# EAGLE board NIPCB (EAGLE 9.7.0)
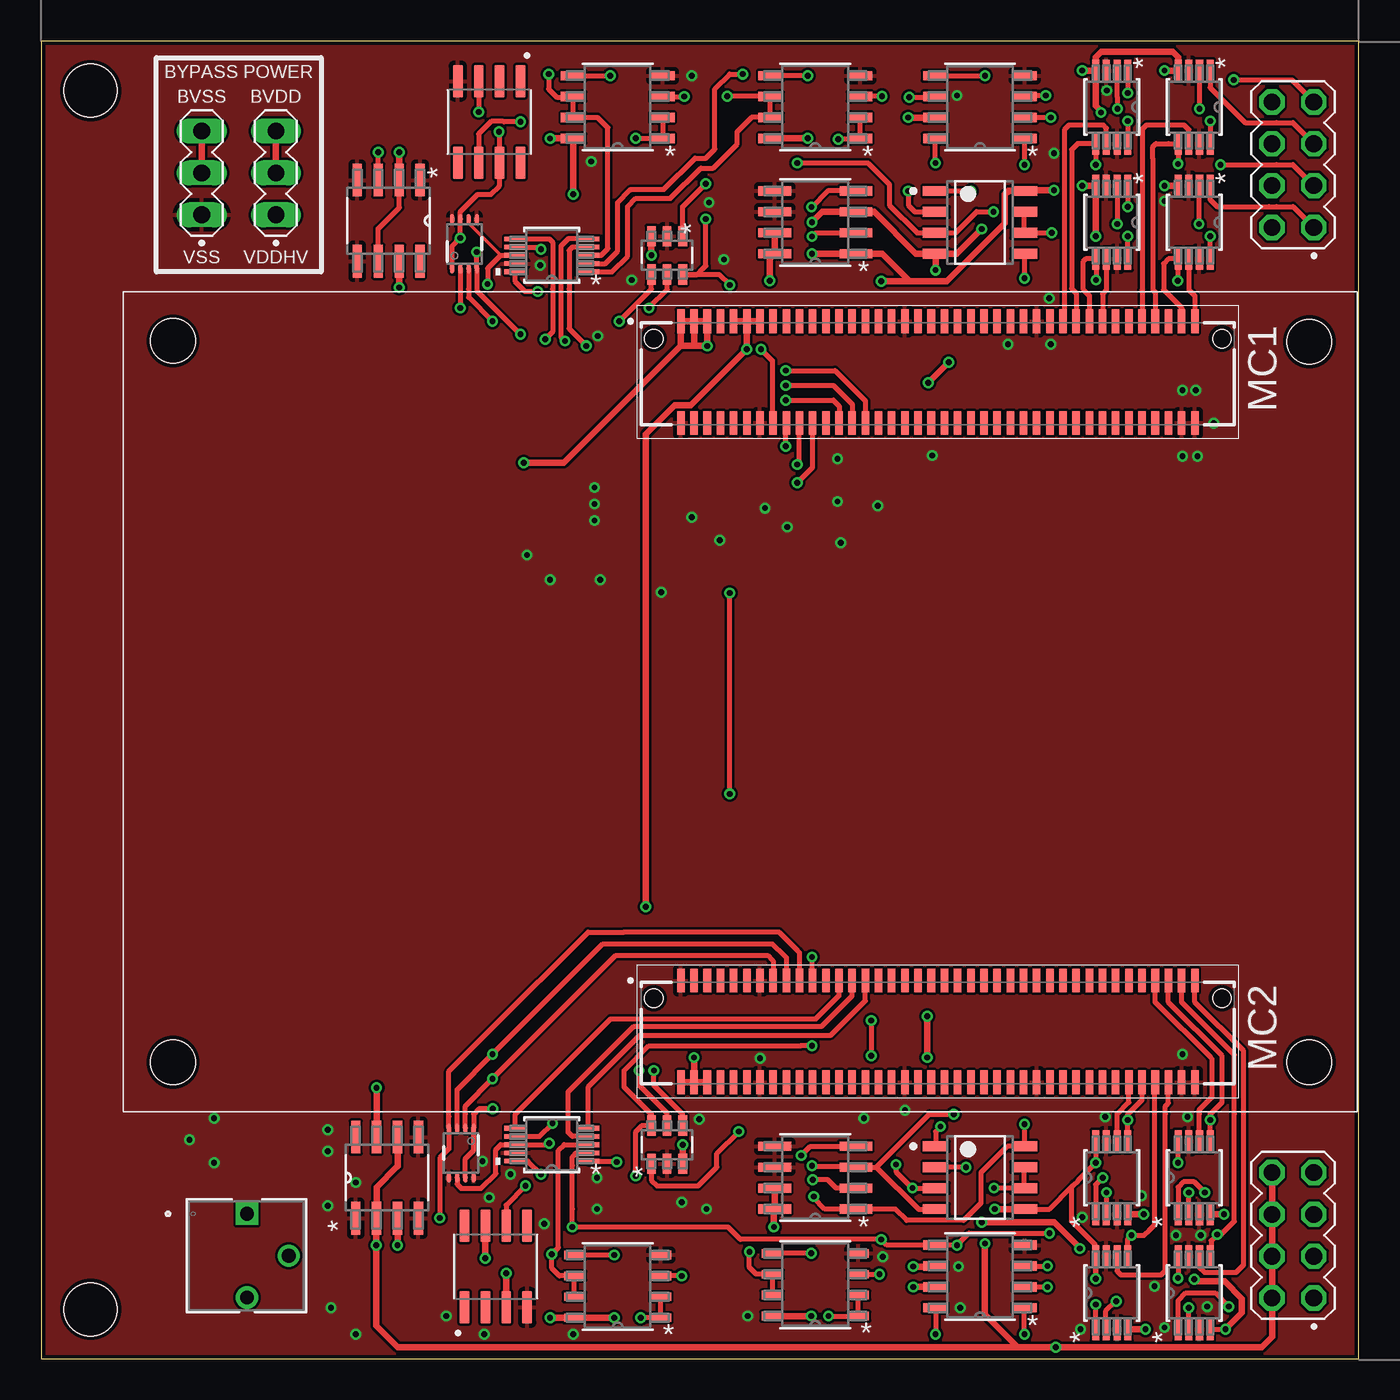
[diagram p6: board, top side]
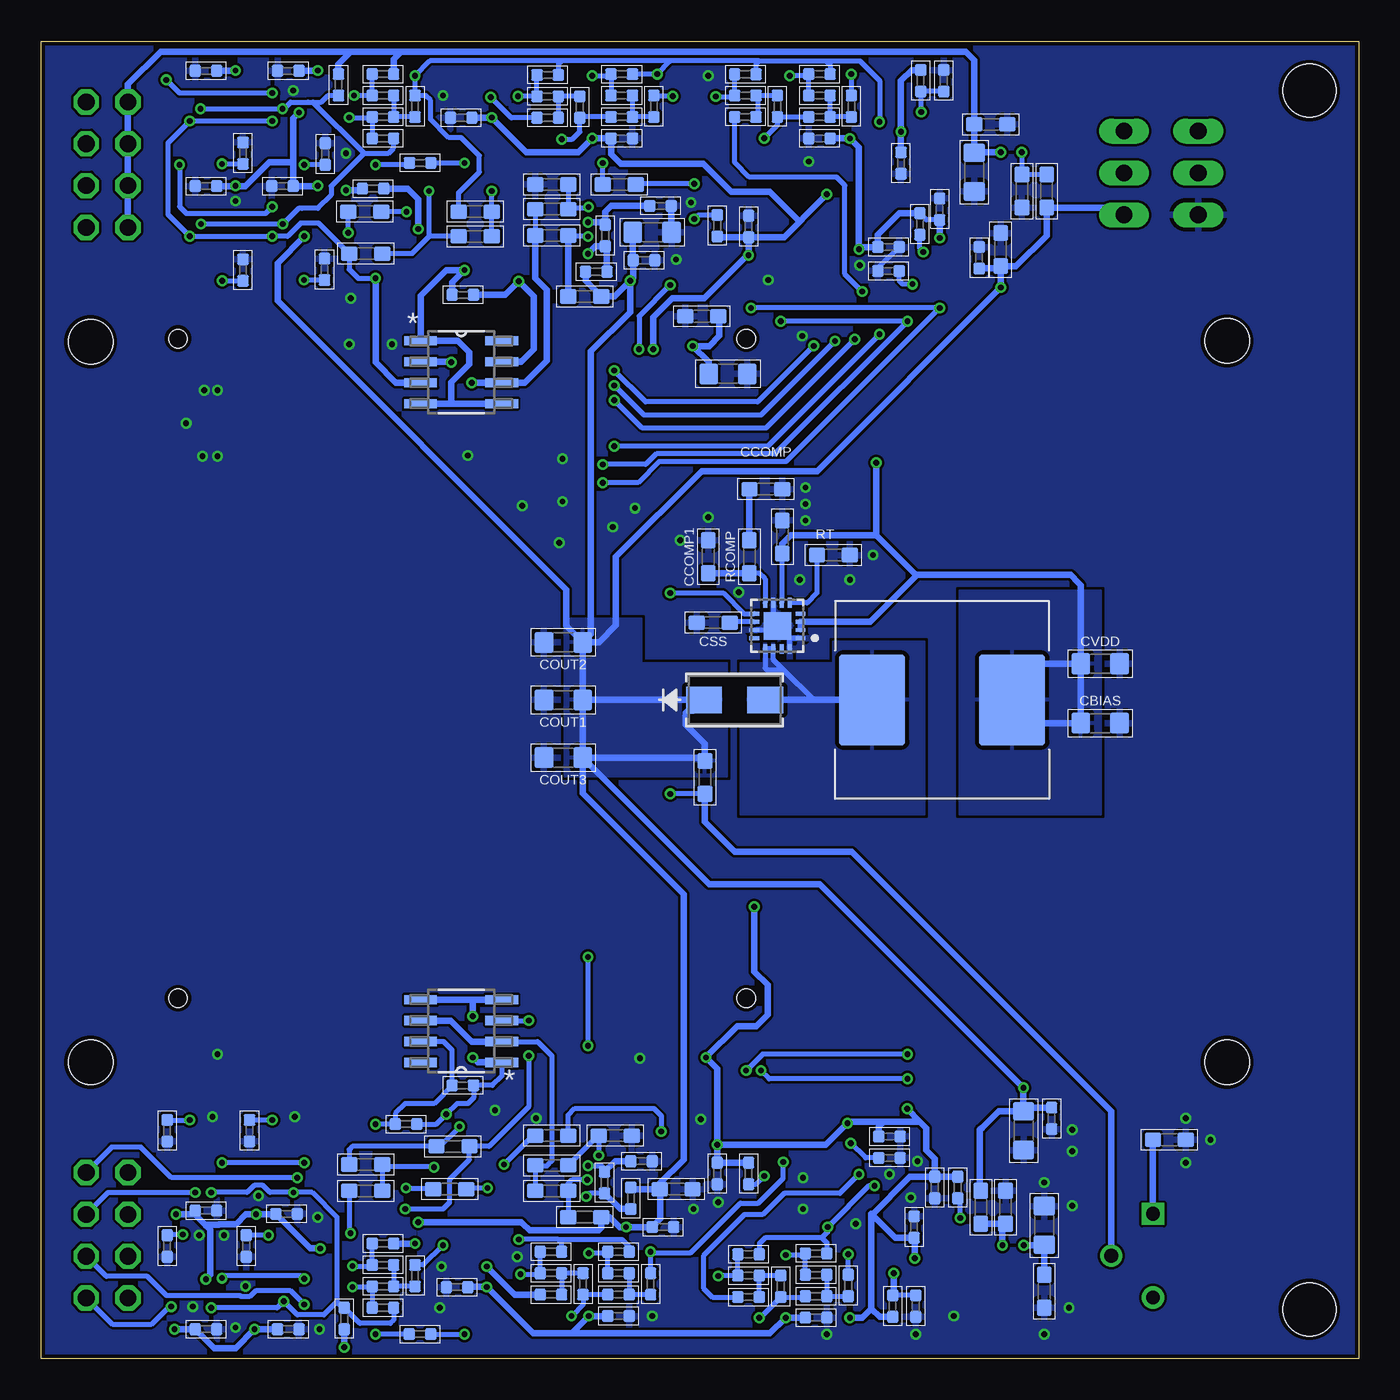
[diagram p7: board, bottom side, seen from below]

Size 80 x 80 mm. Coordinates in mm from the lower left corner, seen from the top.
Outline: 80,80 0,80 0,0 80,0 80,80
Copper layers (1*16): Top 0.035mm / dielectric 1.5mm / Bottom 0.035mm
Design rules "PCBWay-Default": minimum track width 6mil, minimum drill 0.3mm, track to track 6mil, track to pad 6mil, pad to pad 0.2mm, via to via 0.2mm, smd to smd 6mil, copper to edge 0.25mm, drill to drill 8mil, minimum pad ring 6mil, minimum via ring 6mil, stop-mask expansion 4mil, vias tented up to drill 25mil, thermal gap 10mil
Net classes: 1 power: width 0.2 mm
Holes 2.7 mm at 8,18 8,61.8 77,61.75 77,18
Holes 3.2 mm at 3,77 3,3

## Footprints (pad centres in the part's own frame; a part is rotated, then mirrored left to right if it is on the bottom)
DCU0008A_L = smd 0.6 x 0.25: 1 -1.5,0.75; 2 -1.5,0.25; 3 -1.5,-0.25; 4 -1.5,-0.75; 5 1.5,-0.75; 6 1.5,-0.25; 7 1.5,0.25; 8 1.5,0.75
D8 = smd 1.981 x 0.559: 1 -2.464,1.905; 2 -2.464,0.635; 3 -2.464,-0.635; 4 -2.464,-1.905; 5 2.464,-1.905; 6 2.464,-0.635; 7 2.464,0.635; 8 2.464,1.905
D8_TEX = smd 1.46 x 0.559: 1 -2.724,1.905; 2 -2.724,0.635; 3 -2.724,-0.635; 4 -2.724,-1.905; 5 2.724,-1.905; 6 2.724,-0.635; 7 2.724,0.635; 8 2.724,1.905
D8_TEX-L = smd 1.257 x 0.508: 1 -2.623,1.905; 2 -2.623,0.635; 3 -2.623,-0.635; 4 -2.623,-1.905; 5 2.623,-1.905; 6 2.623,-0.635; 7 2.623,0.635; 8 2.623,1.905
RTE0016K-MFG = smd 0.6 x 0.24: 1 -1.4,0.75; 2 -1.4,0.25; 3 -1.4,-0.25; 4 -1.4,-0.75; 9 1.4,-0.75; 10 1.4,-0.25; 11 1.4,0.25; 12 1.4,0.75 | smd 0.24 x 0.6: 5 -0.75,-1.4; 6 -0.25,-1.4; 7 0.25,-1.4; 8 0.75,-1.4; 13 0.75,1.4; 14 0.25,1.4; 15 -0.25,1.4; 16 -0.75,1.4 | smd 1.66 x 1.66: 17 0,0
POT_3362P = drill 0.838 pad 1.346 square: 1 0,0 | drill 0.838 pad 1.346: 2 2.54,2.54; 3 5.08,0
SO8_DIO = smd 1.981 x 0.559: 1 -2.464,1.905; 2 -2.464,0.635; 3 -2.464,-0.635; 4 -2.464,-1.905; 5 2.464,-1.905; 6 2.464,-0.635; 7 2.464,0.635; 8 2.464,1.905
0402 = smd 0.7 x 0.7: 1 -0.65,0; 2 0.65,0
0805 = smd 1.15 x 1.3: 1 -1.175,0; 2 1.175,0
0603 = smd 1 x 0.9: 1 -1,0; 2 1,0
SMA_DIO = smd 2.18 x 1.63: 1 -1.857,0; 2 1.857,0
MK06A = smd 1.219 x 0.533: 1 -1.168,0.95; 2 -1.168,0; 3 -1.168,-0.95; 4 1.168,-0.95; 5 1.168,0; 6 1.168,0.95
D0008A-MFG = smd 1.55 x 0.6: 1 -2.7,1.905; 2 -2.7,0.635; 3 -2.7,-0.635; 4 -2.7,-1.905; 5 2.7,-1.905; 6 2.7,-0.635; 7 2.7,0.635; 8 2.7,1.905
MA04-2_TH_2.54MM = drill 1.016 octagon: 1 -3.81,-1.27; 2 -3.81,1.27; 3 -1.27,-1.27; 4 -1.27,1.27; 5 1.27,-1.27; 6 1.27,1.27; 7 3.81,-1.27; 8 3.81,1.27
MA03-1_TH_2.54MM = drill 1.016 long: 1 -2.54,0; 2 0,0; 3 2.54,0
MSOP-10_MS_LIT = smd 1.333 x 0.279: 1 -2.216,1.001; 2 -2.216,0.5; 3 -2.216,0; 4 -2.216,-0.5; 5 -2.216,-1.001; 6 2.216,-1.001; 7 2.216,-0.5; 8 2.216,0; 9 2.216,0.5; 10 2.216,1.001
SOIC-8_TEX = smd 1.46 x 0.559: 1 -2.724,1.905; 2 -2.724,0.635; 3 -2.724,-0.635; 4 -2.724,-1.905; 5 2.724,-1.905; 6 2.724,-0.635; 7 2.724,0.635; 8 2.724,1.905
SOIC127P599X175-8N = smd 1.97 x 0.6: 1 -2.47,1.905; 2 -2.47,0.635; 3 -2.47,-0.635; 4 -2.47,-1.905; 5 2.47,-1.905; 6 2.47,-0.635; 7 2.47,0.635; 8 2.47,1.905
VSSOP_9DGKR_TEX = smd 1.333 x 0.432: 1 -2.216,0.975; 2 -2.216,0.325; 3 -2.216,-0.325; 4 -2.216,-0.975; 5 2.216,-0.975; 6 2.216,-0.325; 7 2.216,0.325; 8 2.216,0.975
MSS1246-COILCRAFT = smd 5.5 x 4: P$1 0,4.25; P$2 0,-4.25
XEM7310 = smd 0.457 x 1.44: 01 2.65,48.606; 02 2.65,42.434; 03 3.45,48.606; 04 3.45,42.434; 05 4.25,48.606; 06 4.25,42.434; 07 5.05,48.606; 08 5.05,42.434; 09 5.85,48.606; 10 5.85,42.434; 11 6.65,48.606; 12 6.65,42.434; 13 7.45,48.606; 14 7.45,42.434; 15 8.25,48.606; 16 8.25,42.434; 17 9.05,48.606; 18 9.05,42.434; 19 9.85,48.606; 20 9.85,42.434; 21 10.65,48.606; 22 10.65,42.434; 23 11.45,48.606; 24 11.45,42.434; 25 12.25,48.606; 26 12.25,42.434; 27 13.05,48.606; 28 13.05,42.434; 29 13.85,48.606; 30 13.85,42.434; 31 14.65,48.606; 32 14.65,42.434; 33 15.45,48.606; 34 15.45,42.434; 35 16.25,48.606; 36 16.25,42.434; 37 17.05,48.606; 38 17.05,42.434; 39 17.85,48.606; 40 17.85,42.434; 41 18.65,48.606; 42 18.65,42.434; 43 19.45,48.606; 44 19.45,42.434; 45 20.25,48.606; 46 20.25,42.434; 47 21.05,48.606; 48 21.05,42.434; 49 21.85,48.606; 50 21.85,42.434; 51 22.65,48.606; 52 22.65,42.434; 53 23.45,48.606; 54 23.45,42.434; 55 24.25,48.606; 56 24.25,42.434; 57 25.05,48.606; 58 25.05,42.434; 59 25.85,48.606; 60 25.85,42.434; 61 26.65,48.606; 62 26.65,42.434; 63 27.45,48.606; 64 27.45,42.434; 65 28.25,48.606; 66 28.25,42.434; 67 29.05,48.606; 68 29.05,42.434; 69 29.85,48.606; 70 29.85,42.434; 71 30.65,48.606; 72 30.65,42.434; 73 31.45,48.606; 74 31.45,42.434; 75 32.25,48.606; 76 32.25,42.434; 77 33.05,48.606; 78 33.05,42.434; 79 33.85,48.606; 80 33.85,42.434; 81 2.65,8.576; 82 2.65,2.404; 83 3.45,8.576; 84 3.45,2.404; 85 4.25,8.576; 86 4.25,2.404; 87 5.05,8.576; 88 5.05,2.404; 89 5.85,8.576; 90 5.85,2.404; 91 6.65,8.576; 92 6.65,2.404; 93 7.45,8.576; 94 7.45,2.404; 95 8.25,8.576; 96 8.25,2.404; 97 9.05,8.576; 98 9.05,2.404; 99 9.85,8.576; 100 9.85,2.404; 101 10.65,8.576; 102 10.65,2.404; 103 11.45,8.576; 104 11.45,2.404; 105 12.25,8.576; 106 12.25,2.404; 107 13.05,8.576; 108 13.05,2.404; 109 13.85,8.576; 110 13.85,2.404; 111 14.65,8.576; 112 14.65,2.404; 113 15.45,8.576; 114 15.45,2.404; 115 16.25,8.576; 116 16.25,2.404; 117 17.05,8.576; 118 17.05,2.404; 119 17.85,8.576; 120 17.85,2.404; 121 18.65,8.576; 122 18.65,2.404; 123 19.45,8.576; 124 19.45,2.404; 125 20.25,8.576; 126 20.25,2.404; 127 21.05,8.576; 128 21.05,2.404; 129 21.85,8.576; 130 21.85,2.404; 131 22.65,8.576; 132 22.65,2.404; 133 23.45,8.576; 134 23.45,2.404; 135 24.25,8.576; 136 24.25,2.404; 137 25.05,8.576; 138 25.05,2.404; 139 25.85,8.576; 140 25.85,2.404; 141 26.65,8.576; 142 26.65,2.404; 143 27.45,8.576; 144 27.45,2.404; 145 28.25,8.576; 146 28.25,2.404; 147 29.05,8.576; 148 29.05,2.404; 149 29.85,8.576; 150 29.85,2.404; 151 30.65,8.576; 152 30.65,2.404; 153 31.45,8.576; 154 31.45,2.404; 155 32.25,8.576; 156 32.25,2.404; 157 33.05,8.576; 158 33.05,2.404; 159 33.85,8.576; 160 33.85,2.404 | hole 1.1: 1,7.5; 35.5,7.5; 1,47.55; 35.5,47.55

## Placement (x,y rotation side)
ADC.0  ADS7042IDCURDCU0008A_L  [DCU0008A_L]  25.7,67.7 90 top
ADC.1  ADS7042IDCURDCU0008A_L  [DCU0008A_L]  25.5,12.5 270 top
AMPREF.0  OPA552UA/2K5D8  [D8]  21.1,69.1 270 top
AMPREF.1  OPA552UA/2K5D8  [D8]  21,11 90 top
BANDPASSFILTER1.0  OPA2325IDRD8_TEX  [D8_TEX]  47,76 180 top
BANDPASSFILTER1.1  OPA2325IDRD8_TEX-L  [D8_TEX-L]  47,4.5 180 top
BANDPASSFILTER2.0  OPA2325IDRD8_TEX  [D8_TEX]  35,76 180 top
BANDPASSFILTER2.1  OPA2325IDRD8_TEX-L  [D8_TEX-L]  35,4.4 180 top
BOOSTCTRL  LM51581QRTERQ1RTE0016K-MFG  [RTE0016K-MFG]  35.3,44.5 180 bottom
BOOSTFBPOT  3362P-1-103LFPOT_3362P  [POT_3362P]  12.5,8.8 270 top
BOOTSTRAP.0  DMC4047LSD-13SO8_DIO  [SO8_DIO]  47,69 180 top
BOOTSTRAPPER.1  DMC4047LSD-13SO8_DIO  [SO8_DIO]  47,11 180 top
CAC1.0  [0402]  59.25,74.1 180 bottom
CAC1.1  [0402]  59.25,3.1 180 bottom
CAC2.0  [0402]  59.25,78 180 bottom
CAC2.1  [0402]  59.25,7 180 bottom
CADC.0  [0402]  28.55,66.05 0 bottom
CADC.1  [0402]  28.5,12.2 0 bottom
CBIAS  1uF  [0805]  15.7,38.6 0 bottom
CCH1.0  [0402]  70,9 0 bottom
CCH2.0  [0402]  65.35,71.2 180 bottom
CCH3.0  [0402]  70,71.2 180 bottom
CCH4.0  [0402]  65,78.2 180 bottom
CCH5.1  [0402]  65,1.8 0 bottom
CCH6.1  [0402]  65.1,8.8 0 bottom
CCH7.1  [0402]  70,1.8 0 bottom
CCH8.1  [0402]  18.65,14.6 270 bottom
CCOMP  47n  [0603]  36,52.8 0 bottom
CCOMP1  390p  [0603]  39.5,48.7 90 bottom
CDECAP0.0  [0402]  32.75,74.1 180 bottom
CDECAP0.1  [0402]  54.5,75.35 180 bottom
CDECAP1.0  [0402]  25.45,69.8 90 bottom
CDECAP1.1  [0402]  44.75,74.1 0 bottom
CDECAP2.0  [0402]  37.05,68.75 90 bottom
CDECAP2.1  [0402]  54.75,4.35 180 bottom
CDECAP3.0  [0402]  28.55,67.5 0 bottom
CDECAP3.1  [0402]  25.75,10.4 270 bottom
CDECAP4.0  [0402]  32.95,2.5 0 bottom
CDECAP4.1  [0402]  28.5,13.5 0 bottom
CDECAP5.0  [0402]  44.95,2.6 0 bottom
CDECAP5.1  [0402]  38.95,11.25 270 bottom
CDECAP6.0  [0402]  45.75,68.2 90 bottom
CDECAP6.1  [0402]  45.8,10.7 90 bottom
CDECAP7.0  [0402]  59.85,71.05 0 bottom
CDECAP7.1  [0402]  57.85,14.25 0 bottom
CDECAP7.2  [0402]  54.4,64.6 180 bottom
CDECAP7.3  [0402]  54.4,16.6 0 bottom
CDECAP8.0  [0402]  23.05,66.85 90 bottom
CDECAP8.1  [0402]  42.25,8 0 bottom
CDECAP9.0  [0402]  43.4,66.7 0 bottom
CDECAP9.1  [0402]  70,78.2 180 bottom
CDECAPREF.0  [0402]  27.8,72.6 270 bottom
CDECAPREF.1  [0402]  27,8 90 bottom
CDECAPXEM0  [0805]  38.3,59.8 0 bottom
CDECAPXEM1  [0603]  35,49.9 90 bottom
CDECAPXEM2  [0603]  39.9,63.3 180 bottom
CH1.0  [0402]  49.25,75.35 0 bottom
CH1.1  [0402]  49.05,3.9 180 bottom
CH2.0  [0402]  49.25,76.65 0 bottom
CH2.1  [0402]  49.05,5.2 180 bottom
CH3.0  [0402]  37.25,75.4 0 bottom
CH3.1  [0402]  37.05,3.75 180 bottom
CH4.0  [0402]  37.25,76.7 0 bottom
CH4.1  [0402]  37.05,5.05 180 bottom
CL1.0  [0402]  42.8,76.05 270 bottom
CL1.1  [0402]  43,4.55 90 bottom
CL2.0  [0402]  44.75,78 0 bottom
CL2.1  [0402]  44.95,6.5 180 bottom
CL3.0  [0402]  30.81,76.05 270 bottom
CL3.1  [0402]  31,4.45 90 bottom
CL4.0  [0402]  32.75,78 0 bottom
CL4.1  [0402]  32.95,6.4 180 bottom
COUT1  1uF  [0805]  48.3,40 180 bottom
COUT2  100nF  [0805]  48.3,43.5 180 bottom
COUT3  100nF  [0805]  48.3,36.5 180 bottom
CREF0.0  [0603]  21.75,67.35 90 bottom
CREF0.1  [0603]  41.45,10.3 0 bottom
CREF1.0  [0805]  42.9,68.4 0 bottom
CREF1.1  [0805]  20.35,13.85 270 bottom
CREF2.0  [0603]  22.35,74.95 0 bottom
CREF2.1  [0603]  19.1,4.1 270 bottom
CREF3.0  [0805]  23.35,72.05 270 bottom
CREF3.1  [0805]  19.1,8.1 90 bottom
CRFI.0  [0402]  61.95,77.35 270 bottom
CRFI.1  [0402]  61.6,2.45 270 bottom
CSS  12n  [0603]  39.2,44.7 180 bottom
CVDD  10uF  [0805]  15.7,42.2 0 bottom
D1  B160-13-FSMA_DIO  [SMA_DIO]  37.9,40 0 bottom
DAC.0  DAC081S101CIMKX/NOPBMK06A  [MK06A]  38,67 270 top
DAC.1  DAC081S101CIMKX/NOPBMK06A  [MK06A]  38,13 90 top
HPAMPS.0  OPA2991IDRD0008A-MFG  [D0008A-MFG]  57,69 0 top
HPAMPS.1  OPA2991IDRD0008A-MFG  [D0008A-MFG]  57,11 0 top
J1  MA04-2_TH_2.54MM  [MA04-2_TH_2.54MM]  76,72.5 90 top
J2  MA04-2_TH_2.54MM  [MA04-2_TH_2.54MM]  76,7.5 90 top
J3  MA03-1_TH_2.54MM  [MA03-1_TH_2.54MM]  9.75,72 90 top
J4  MA03-1_TH_2.54MM  [MA03-1_TH_2.54MM]  14.25,72 90 top
NAREFH.0  [0402]  26.6,77.6 90 bottom
NAREFH.1  [0402]  28.3,3.2 270 bottom
NAREFL.0  [0402]  25.2,77.6 270 bottom
NAREFL.1\  [0402]  26.9,3.2 90 bottom
OUTBUFFER.0  OPA552UA/2K5D8  [D8]  54.5,59.9 0 bottom
OUTBUFFER.1  OPA552UA/2K5D8  [D8]  54.5,19.9 180 bottom
PGA.0  LTC6911CMS-1TRPBFMSOP-10_MS_LIT  [MSOP-10_MS_LIT]  31,67 180 top
PGA.1  LTC6911CMS-1TRPBFMSOP-10_MS_LIT  [MSOP-10_MS_LIT]  31,13 180 top
PREAMPLIFIER.0  INA818IDSOIC-8_TEX  [SOIC-8_TEX]  57,76 180 top
PREAMPLIFIER.1  INA818IDSOIC-8_TEX  [SOIC-8_TEX]  57,5 180 top
RAC1.0  [0402]  59.25,75.4 180 bottom
RAC1.1  [0402]  59.25,4.4 180 bottom
RAC2.0  [0402]  59.25,76.7 0 bottom
RAC2.1  [0402]  59.25,5.7 0 bottom
RAC3.0  [0402]  57.3,76.05 90 bottom
RAC3.1  [0402]  57.3,5.05 90 bottom
RADC.1  [0402]  24.35,10.4 90 bottom
RADC.3  [0402]  26.65,68.9 90 bottom
RBOOSTFB0  2.5k  [0603]  11.5,13.3 180 bottom
RBOOSTFB1  100k  [0603]  39.7,35.3 90 bottom
RBOOSTMID0.0  22k  [0603]  18.95,70.9 270 bottom
RBOOSTMID0.1  22k  [0603]  21.45,9.2 270 bottom
RBOOSTMID1.0  22k  [0603]  20.45,70.9 90 bottom
RBOOSTMID1.1  22k  [0603]  22.95,9.2 90 bottom
RBOOT0.0  [0603]  49,71.3 0 bottom
RBOOT0.1  [0603]  45.15,13.55 180 bottom
RBOOT1.0  [0603]  49,69.8 180 bottom
RBOOT1.1  [0603]  49,11.75 180 bottom
RBOOT2.0  [0603]  49,68.2 0 bottom
RBOOT2.1  [0603]  49,10.2 0 bottom
RBOOT3.0  [0603]  47,64.5 0 bottom
RBOOT3.1  [0603]  47,8.6 0 bottom
RBYPASSVDD  [0402]  46.3,66 0 bottom
RBYPASSVDD.1  [0402]  44.2,9.75 270 bottom
RBYPASSVSS  [0402]  42.4,70 180 bottom
RBYPASSVSS.1  [0402]  43.55,12 180 bottom
RCH1.0  [0402]  67.75,66.1 90 bottom
RCH2.0  [0402]  62.8,66.15 90 bottom
RCH3.0  [0402]  67.75,73.2 90 bottom
RCH5.0  [0402]  72.35,6.85 270 bottom
RCH6.0  [0402]  67.55,6.85 270 bottom
RCH7.0  [0402]  72.35,13.85 270 bottom
RCH8.0  [0402]  67.35,13.85 270 bottom
RCH.40  [0402]  62.75,73.15 90 bottom
RCOMP  1.47k  [0603]  37,48.7 90 bottom
RDAC.1  [0402]  37.05,11.25 270 bottom
RDAC.2  [0402]  38.95,68.8 90 bottom
RGAINPREAMP.0  [0402]  56.99,72.61 180 bottom
RGAINPREAMP.1  [0402]  57,1.5 180 bottom
RH1.0  [0402]  47.3,76 90 bottom
RH1.1  [0402]  47.1,4.55 90 bottom
RH2.0  [0402]  49.25,77.95 0 bottom
RH2.1  [0402]  49.05,6.5 180 bottom
RH3.0  [0402]  35.3,76.05 90 bottom
RH3.1  [0402]  35.1,4.4 90 bottom
RH4.0  [0402]  37.25,77.99 0 bottom
RH4.1  [0402]  37.05,6.35 180 bottom
RHP0.0  [0603]  60.35,69.65 180 bottom
RHP0.1  [0603]  60.3,10.2 180 bottom
RHP1.0  [0603]  53.65,69.65 0 bottom
RHP1.1  [0603]  60.3,11.8 0 bottom
RHP2.0  [0603]  44.9,71.3 0 bottom
RHP2.1  [0603]  49,13.55 0 bottom
RHP3.0  [0603]  53.65,68.15 180 bottom
RHP3.1  [0603]  55.2,10.3 0 bottom
RL1.0  [0402]  44.75,75.4 0 bottom
RL1.1  [0402]  44.95,3.9 0 bottom
RL2.0  [0402]  44.75,76.7 180 bottom
RL2.1  [0402]  44.95,5.2 180 bottom
RL3.0  [0402]  32.75,76.7 180 bottom
RL3.1  [0402]  32.95,3.8 0 bottom
RL4.0  [0402]  32.75,75.4 0 bottom
RL4.1  [0402]  32.95,5.1 180 bottom
RSTIM.0  [0603]  60.3,67.1 180 bottom
RSTIM.1  [0603]  55,12.9 180 bottom
RT  26.7k  [0603]  31.9,48.8 0 bottom
U1  BUF634AIDR  [SOIC127P599X175-8N]  27.2,75.1 270 top
U2  BUF634AIDR  [SOIC127P599X175-8N]  27.6,5.6 90 top
U4  TMUX7219DGKRVSSOP_9DGKR_TEX  [VSSOP_9DGKR_TEX]  70,69 270 top
U5  TMUX7219DGKRVSSOP_9DGKR_TEX  [VSSOP_9DGKR_TEX]  65,69 270 top
U6  TMUX7219DGKRVSSOP_9DGKR_TEX  [VSSOP_9DGKR_TEX]  70,76 270 top
U7  TMUX7219DGKRVSSOP_9DGKR_TEX  [VSSOP_9DGKR_TEX]  65,76 270 top
U8  TMUX7219DGKRVSSOP_9DGKR_TEX  [VSSOP_9DGKR_TEX]  70,4 90 top
U10  TMUX7219DGKRVSSOP_9DGKR_TEX  [VSSOP_9DGKR_TEX]  65,4 90 top
U11  TMUX7219DGKRVSSOP_9DGKR_TEX  [VSSOP_9DGKR_TEX]  70,11 90 top
U12  TMUX7219DGKRVSSOP_9DGKR_TEX  [VSSOP_9DGKR_TEX]  65,11 90 top
U$1  MSS1246-COILCRAFT  [MSS1246-COILCRAFT]  25.3,40 270 bottom
U$2  XEM7310  [XEM7310]  36.19,14.39 0 top

## Tracks (layer width: path | path; a pad name or v marks a point on that pad's centre or on a via)
BANDPASSOUT1.0  (via drill 0.35)
  Top 0.3: 44.28,75.4 BANDPASSFILTER1.0.6 44.26,76.65 v41.65,76.65 | 44.28,75.4 BANDPASSFILTER1.0.7 | PGA.0.1 34.65,66 35.6,66.95 35.6,69.95 36.1,70.45 38.2,70.45 40.05,72.3 40.8,72.3 42.25,73.75 42.25,74.5 43.1,75.35 43.15,75.4 44.28,75.4
  Bottom 0.3: v41.65,76.65 42.75,76.65 CL1.0.1
BANDPASSOUT1.1  (via drill 0.35)
  Top 0.3: BANDPASSFILTER1.1.7 BANDPASSFILTER1.1.6 43.41,5.13 43.4,5.15 43,5.55 v43,6.5 | v34.95,11.95 33.27,11.95 PGA.1.1
  Bottom 0.3: CL1.1.2 v43,6.5 42.95,6.45 40.55,6.45 37.55,9.45 36.45,9.45 34.95,10.95 v34.95,11.95
BANDPASSOUT2.0  (via drill 0.35)
  Top 0.3: PGA.0.3 34,67 34.4,67.4 34.4,74.75 33.8,75.35 33.78,75.37 BANDPASSFILTER2.0.7 BANDPASSFILTER2.0.6 32.24,76.6 31.3,76.6 30.81,77.09 v30.81,78
  Bottom 0.3: v30.81,78 CL3.0.1
BANDPASSOUT2.1  (via drill 0.35)
  Top 0.3: BANDPASSFILTER2.1.7 BANDPASSFILTER2.1.6 31.46,5.03 31.45,5.05 31,5.5 v31,6.35 31.4,6.75 31.4,12.65 31.75,13 PGA.1.3
  Bottom 0.3: CL3.1.2 v31,6.35
BOOSTCTLCOMP
  Bottom 0.3: BOOSTCTRL.8 36.05,47.35 36.4,47.7 RCOMP.1
  Bottom 0.4: CCOMP1.1 RCOMP.1
BOOSTCTLCOMP2
  Bottom 0.4: RCOMP.2 CCOMP.1
BOOSTCTLOUT
  Bottom 0.3: 34.95,41.85 33.1,40 | 34.95,41.85 35.55,42.45 35.55,42.5 BOOSTCTRL.14 BOOSTCTRL.13 36.05,41.95 36,41.9 35.95,41.85 34.95,41.85
  Bottom 0.4: U$1.P$2 32.9,40 33.1,40 D1.2
  pour Bottom: 35.44,42.24 35.42,42.22 31.98,42.22 31.96,42.24 31.94,42.26 31.92,42.28 31.92,43.52 26.38,43.52 26.38,33.08 37.52,33.08 37.52,42.22 36.18,42.22 36.16,42.24 36.14,42.26 36.12,42.28 36.12,43.42 35.48,43.42 35.48,42.28 35.46,42.26
BOOSTCTLRT
  Bottom 0.3: RT.1 32.9,46.5 33.5,45.9 BOOSTCTRL.5
BOOSTCTLSS
  Bottom 0.152: 38.15,44.75 CSS.1
  Bottom 0.3: BOOSTCTRL.10 38.15,44.75
BOOSTFB  (via drill 0.35)
  Top 0.3: v41.8,34.3 v41.8,46.5
  Bottom 0.3: RBOOSTFB1.1 v41.8,34.3 | v41.8,46.5 38.6,46.5 37.35,45.25 BOOSTCTRL.9
  Bottom 0.4: BOOSTFBPOT.2 15.04,15.04 30.8,30.8 37.9,30.8 39.7,32.6 RBOOSTFB1.1
BOOTNG.0  (via drill 0.35)
  Top 0.3: v46.8,68.14 47.02,68.36 BOOTSTRAP.0.2
  Bottom 0.3: RBOOT2.0.2 46.85,68.2 v46.8,68.14
  Bottom 0.4: RBOOT2.0.2 48,67.1 RBOOT3.0.1
BOOTNG.1  (via drill 0.35)
  Top 0.3: BOOTSTRAPPER.1.2 48.26,10.36 47.75,10.88 46.86,10.88 v46.85,10.86
  Bottom 0.3: v46.85,10.86 47.78,10.86 48,10.65 RBOOT2.1.2 RBOOT3.1.1
BOOTPG.0  (via drill 0.35)
  Top 0.3: BOOTSTRAP.0.4 47.76,70.91 46.78,69.93 v46.77,69.93
  Bottom 0.3: RBOOT0.0.2 RBOOT1.0.1 47.9,69.9 46.8,69.9 v46.77,69.93
BOOTPG.1  (via drill 0.35)
  Top 0.3: v46.15,12.35 46.7,12.91 BOOTSTRAPPER.1.4
  Bottom 0.3: RBOOT1.1.1 46.2,13.55 RBOOT0.1.2 v46.15,12.35
CH1
  Top 0.3: U4.1 70.97,70.38 71.3,70.05 71.4,69.95 74.55,69.95 75.01,69.95 76.01,69.95 J1.1
CH2  (via drill 0.35)
  Top 0.3: U5.1 v65.97,69.95 | v71.6,72.5 75,72.5 76,72.5 J1.3
  Bottom 0.3: v65.97,69.95 66.38,69.55 71.2,69.55 71.6,69.95 v71.6,72.5
CH3
  Top 0.3: U6.1 70.97,77.17 73.1,75.05 74.99,75.05 75.99,75.05 J1.5
CH4  (via drill 0.35)
  Top 0.3: U7.1 v65.97,76.85 | v72.4,77.65 74.93,77.65 75.93,77.65 J1.7
  Bottom 0.3: v65.97,76.85 71.6,76.85 v72.4,77.65
CH5  (via drill 0.35)
  Top 0.3: U8.1 69.03,3.52 69.5,4 71.27,4 v72.1,3.17
  Bottom 0.3: J2.1 75.68,2.1 73.3,2.1 72.23,3.17 v72.1,3.17
CH6  (via drill 0.35)
  Top 0.3: U10.1 v64.03,3.3
  Bottom 0.3: J2.3 76.04,5 73.55,5 72.38,3.83 67.92,3.83 67.86,3.77 67.34,3.77 66.98,4.13 64.86,4.13 v64.03,3.3
CH7  (via drill 0.35)
  Top 0.3: U11.1 69.03,10.43 69.35,10.75 70,10.75 v70.65,10.1
  Bottom 0.3: v70.65,10.1 75.94,10.1 J2.5
CH8  (via drill 0.35)
  Top 0.3: U12.1 64.03,10.57 v64.45,11
  Bottom 0.3: v64.45,11 72.1,11 73.95,12.85 75.73,12.85 J2.7
DIG_CSN_ADC.0  (via drill 0.35)
  Top 0.3: v26.45,67.2 ADC.0.4 26.45,64.95 26.45,64.85 v29.1,62.2 | v45.2,55.4 45.2,56.78 U$2.18
  Bottom 0.3: v26.45,67.2 26.65,67.4 RADC.3.1 | v29.1,62.2 35.9,55.4 v45.2,55.4
DIG_CSN_ADC.1  (via drill 0.35)
  Top 0.3: v24.2,8.55 24.2,12.2 24.75,12.75 ADC.1.4 24.75,14.7 24.75,17.45 27.25,19.95 27.3,20 33.2,25.9 35.4,25.9 44.8,25.9 45.9,24.8 46.04,24.66 U$2.99
  Bottom 0.3: v24.2,8.55 24.2,9.6 RADC.1.1
DIG_CSN_HP_DAC.0  (via drill 0.35)
  Top 0.3: v40.35,69.2 40.35,66.35 40.2,66.2 39.83,65.83 DAC.0.6 41.17,65.83 v41.8,65.2 | v43.7,61.3 44.4,60.6 44.4,58 44.4,56.86 U$2.16
  Bottom 0.3: v40.35,69.2 40.1,69.45 RDAC.2.2 | v41.8,65.2 43.7,63.3 v43.7,61.3
DIG_CSN_HP_DAC.1  (via drill 0.35)
  Top 0.3: v36.1,11.1 36.1,13.8 36.4,14.1 36.47,14.17 DAC.1.6 37.05,14.85 35.4,16.5 35.4,17.5 36.9,19 46.1,19 v46.8,19 | v46.8,24.4 46.8,23.01 U$2.101
  Bottom 0.3: RDAC.1.2 36.6,10.6 v36.1,11.1 | v46.8,19 v46.8,24.4
DIG_ENABLECH1.0  (via drill 0.35)
  Top 0.3: v69,65.45 69,66.76 U4.5 68.43,66.78 68.15,66.5 68.15,64.9 69.24,63.81 U$2.77
  Bottom 0.3: v69,65.45 RCH1.0.1
DIG_ENABLECH1.1  (via drill 0.35)
  Top 0.3: U8.5 71.03,6.27 71.03,7.18 v71.4,7.55 71.65,7.55 72.45,8.35 72.45,14.85 72.45,18.45 69.24,21.66 U$2.157
  Bottom 0.3: RCH5.0.1 72.3,7.55 v71.4,7.55
DIG_ENABLECH2.0  (via drill 0.35)
  Top 0.3: v64.05,65.5 64.05,66.76 U5.5 63.43,66.78 63.25,66.6 63.25,64.94 63.64,64.55 U$2.63
  Bottom 0.3: RCH2.0.1 v64.05,65.5
DIG_ENABLECH2.1  (via drill 0.35)
  Top 0.3: U10.5 65.97,7.27 v66.2,7.5 66.95,7.5 67.3,7.85 67.6,8.15 67.6,14.85 67.6,16.75 U$2.154
  Bottom 0.3: v66.2,7.5 RCH6.0.1
DIG_ENABLECH3.0  (via drill 0.35)
  Top 0.3: v69.03,72.55 U6.5 68.43,73.78 67.68,73.78 67.65,73.75 67.5,73.6 67.5,72.85 67.5,64.9 67.64,64.76 U$2.73
  Bottom 0.3: v69.03,72.55 RCH3.0.1
DIG_ENABLECH3.1  (via drill 0.35)
  Top 0.3: U11.5 v70.97,14.5 70.97,14.85 71.7,15.57 71.7,18.2 71.7,18.4 68.5,21.6 68.44,21.66 U$2.155
  Bottom 0.3: RCH7.0.1 v70.97,14.5
DIG_ENABLECH4.0  (via drill 0.35)
  Top 0.3: v64.02,72.5 v64.03,72.5 U7.5 62.93,73.78 62.57,73.42 62.57,64.98 62.84,64.71 U$2.61
  Bottom 0.3: RCH.40.1 v64.02,72.5
DIG_ENABLECH4.1  (via drill 0.35)
  Top 0.3: U12.5 v65.97,14.5 65.97,14.85 66.84,15.71 U$2.152
  Bottom 0.3: v65.97,14.5 RCH8.0.1
DIG_PGAGAIN0.0  (via drill 0.35)
  Top 0.3: PGA.0.4 32.25,67.5 32.1,67.35 32.05,67.3 32.05,64.95 32.05,62.55 v33.1,61.5 | v45.2,60 48.2,60 50,58.2 50.04,58.16 U$2.30
  Bottom 0.3: v33.1,61.5 36.5,58.1 43.3,58.1 v45.2,60
DIG_PGAGAIN0.1
  Top 0.3: PGA.1.4 32.25,13.5 32,13.75 32,16.2 35.99,20.19 47.39,20.19 48.4,21.2 49.24,22.04 U$2.107
DIG_PGAGAIN1.0  (via drill 0.35)
  Top 0.3: PGA.0.5 32,68 31.65,67.65 31.55,67.55 31.55,64.95 31.55,62.05 v31.8,61.8 | v45.2,59.1 48.1,59.1 49.2,58 49.24,57.96 U$2.28
  Bottom 0.3: v31.8,61.8 36.3,57.3 43.4,57.3 v45.2,59.1
DIG_PGAGAIN1.1
  Top 0.3: U$2.109 50.04,21.74 47.95,19.65 36.35,19.65 33.22,16.52 PGA.1.5
DIG_PGAGAIN2.0  (via drill 0.35)
  Top 0.3: PGA.0.6 30.85,68 31.05,67.8 31.05,64.95 31.05,62.35 v30.6,61.9 | v45.2,58.2 48.1,58.2 48.4,57.9 48.44,57.86 U$2.26
  Bottom 0.3: v30.6,61.9 36,56.5 43.5,56.5 v45.2,58.2
DIG_PGAGAIN2.1
  Top 0.3: PGA.1.6 28.78,14.85 34.57,20.64 47.04,20.64 48.4,22 48.44,22.04 U$2.105
DIG_SCLK.0  (via drill 0.35)
  Top 0.3: DAC.0.5 38,64.95 38,64.9 v36.9,63.8 | ADC.0.2 25.45,64.95 v25.45,63.8 | v45.9,53.2 46.84,54.13 U$2.22
  Bottom 0.3: v36.9,63.8 v25.45,63.8 34.78,54.47 42.49,54.47 43.76,53.2 v45.9,53.2
DIG_SCLK.1  (via drill 0.35)
  Top 0.3: ADC.1.2 25.75,14.85 25.75,15.35 v27.4,17 34.9,24.5 43.7,24.5 44.1,24.5 44.4,24.2 44.44,24.16 U$2.95 | DAC.1.5 38,14.9 36.3,16.6 v36.3,17.5
  Bottom 0.3: v27.4,17 35.8,17 v36.3,17.5
DIG_SDA.0  (via drill 0.35)
  Top 0.3: DAC.0.4 37.05,64.95 v35.1,63 | ADC.0.3 25.95,64.95 25.95,64.45 v27.4,63 | v45.9,54.3 46.04,54.44 U$2.20
  Bottom 0.3: v35.1,63 v27.4,63 35.45,54.95 42.65,54.95 43.3,54.3 v45.9,54.3
DIG_SDA.1  (via drill 0.35)
  Top 0.3: ADC.1.3 25.25,14.85 25.25,16.35 v27.4,18.5 34.1,25.2 44.4,25.2 45.1,24.5 45.24,24.36 U$2.97 | DAC.1.4 38.95,14.85 37.2,16.6 v37.2,17.5
  Bottom 0.3: v27.4,18.5 36.2,18.5 v37.2,17.5
DIG_SELECTCH1.0
  Top 0.3: U4.6 69.67,64.9 70.04,64.53 U$2.79
DIG_SELECTCH1.1
  Top 0.3: U8.6 70.33,5.56 70.63,5.25 72.55,5.25 73,5.7 73,14.85 73,18.7 70.1,21.6 70.04,21.66 U$2.159
DIG_SELECTCH2.0
  Top 0.3: U5.6 64.67,64.9 64.44,64.66 U$2.65
DIG_SELECTCH2.1
  Top 0.3: U10.6 65.33,5.33 65.55,5.1 68,5.1 68.25,5.35 68.25,14.85 68.25,15.35 68.4,15.5 68.44,15.54 U$2.156
DIG_SELECTCH3.0
  Top 0.3: U6.6 69.67,74.62 69.4,74.9 67.1,74.9 66.85,74.65 66.85,64.9 U$2.71
DIG_SELECTCH3.1
  Top 0.3: U11.6 70.33,14.85 70.33,15.12 71.1,15.9 71.1,18.2 71,18.3 67.64,21.66 U$2.153
DIG_SELECTCH4.0
  Top 0.3: U7.6 64.67,74.72 64.5,74.9 62.4,74.9 62.12,74.62 62.12,64.9 62.12,63.07 U$2.59
DIG_SELECTCH4.1
  Top 0.3: U12.6 65.33,14.85 66.04,15.57 U$2.150
GAIN1.0  (via drill 0.35)
  Top 0.3: v54.3,72.61 54.28,72.63 PREAMPLIFIER.0.8
  Bottom 0.3: RGAINPREAMP.0.1 v54.3,72.61
GAIN1.1  (via drill 0.35)
  Top 0.3: v54.3,1.5 54.3,3.07 PREAMPLIFIER.1.8
  Bottom 0.3: RGAINPREAMP.1.1 v54.3,1.5
GAIN2.0  (via drill 0.35)
  Top 0.3: v59.7,72.5 59.7,74.07 PREAMPLIFIER.0.1
  Bottom 0.3: RGAINPREAMP.0.2 57.75,72.5 v59.7,72.5
GAIN2.1  (via drill 0.35)
  Top 0.3: v59.7,1.5 59.7,3.07 PREAMPLIFIER.1.1
  Bottom 0.3: RGAINPREAMP.1.2 v59.7,1.5
HCP_BUF.0  (via drill 0.35)
  Top 0.3: HPAMPS.0.7 HPAMPS.0.6 v61.35,68.36
  Bottom 0.3: v61.35,68.36 RHP0.0.2
HCP_BUF.1  (via drill 0.35)
  Top 0.3: HPAMPS.1.7 HPAMPS.1.6 v57.85,10.36
  Bottom 0.3: v57.85,10.36 56.27,10.36 RHP3.1.1
HCP_M.0  (via drill 0.35)
  Top 0.3: v52.65,70.9 52.65,70.05 53.05,69.65 53.06,69.64 HPAMPS.0.2
  Bottom 0.3: RHP3.0.1 RHP1.0.2 v52.65,70.9
HCP_M.1  (via drill 0.35)
  Top 0.3: v56.15,11.64 HPAMPS.1.2
  Bottom 0.3: 59.3,11.65 RHP1.1.2 | 59.3,11.65 RHP0.1.1 | v56.15,11.64 56.16,11.65 59.3,11.65
HCP_P.0  (via drill 0.35)
  Top 0.3: v45.9,72.6 50.2,72.6 51.5,71.3 51.5,70.05 53.15,68.4 53.19,68.36 HPAMPS.0.3 55.52,68.36 56.8,69.65 v57.82,69.65
  Bottom 0.3: RHP2.0.1 v45.9,72.6 | v57.82,69.65 RHP0.0.1
HCP_P.1  (via drill 0.35)
  Top 0.3: HPAMPS.1.3 v52.9,10.36 51.9,11.36 v51.9,11.8
  Bottom 0.3: v52.9,10.36 54.13,10.36 RHP3.1.2 | RHP2.1.1 50.15,13.55 v51.9,11.8
HCP_VSTIM.0  (via drill 0.35)
  Top 0.3: v56.45,70.9 HPAMPS.0.1
  Bottom 0.3: RHP3.0.2 56.45,68.15 | 56.45,68.15 57.5,67.1 RSTIM.0.1 | 56.45,68.15 v56.45,70.9
HCP_VSTIM.1  (via drill 0.35)
  Top 0.3: v54.6,14.1 54.3,13.8 HPAMPS.1.1
  Bottom 0.3: RHP1.1.1 61.3,12.7 61.1,12.9 56.45,12.9 56.25,12.9 RSTIM.1.2 55.8,12.9 v54.6,14.1
HIGHPASSOUT1.0  (via drill 0.35)
  Top 0.3: BANDPASSFILTER1.0.2 BANDPASSFILTER1.0.1 49.68,74.05 v48.4,74.05
  Bottom 0.3: RL1.0.1 47.25,75.4 RH1.0.1 47.3,74.5 47.75,74.05 v48.4,74.05
HIGHPASSOUT1.1  (via drill 0.35)
  Top 0.3: BANDPASSFILTER1.1.2 BANDPASSFILTER1.1.1 v47.8,2.6
  Bottom 0.3: RL1.1.1 RH1.1.1 47.1,3.3 v47.8,2.6
HIGHPASSOUT2.0  (via drill 0.35)
  Top 0.3: BANDPASSFILTER2.0.2 BANDPASSFILTER2.0.1 v36.1,74.09 v36.1,74.1
  Bottom 0.3: RL4.0.1 RH3.0.1 35.3,74.9 v36.1,74.1
HIGHPASSOUT2.1  (via drill 0.35)
  Top 0.3: BANDPASSFILTER2.1.2 BANDPASSFILTER2.1.1 v36.41,2.49 v36.4,2.5
  Bottom 0.3: RL3.1.1 33.65,3.75 RH3.1.1 36.35,2.5 v36.4,2.5
HP_IN.0  (via drill 0.35)
  Top 0.3: DAC.0.1 38.95,69.95 v40.35,71.35
  Bottom 0.3: RHP2.0.2 43.85,71.35 v40.35,71.35
HP_IN.1  (via drill 0.35)
  Top 0.3: DAC.1.1 37.05,10.85 37.4,10.5 39.89,10.5 41.03,11.64 41.03,12.48 v42.35,13.8
  Bottom 0.3: v42.35,13.8 42.35,14.75 42.8,15.2 47.6,15.2 48,14.8 RHP2.1.2
HP_OUT.0  (via drill 0.35)
  Top 0.3: HPAMPS.0.5 v59.7,65.6 | U4.8 v70.97,68.15 | v70.97,75.15 U6.8 | U5.8 v65.97,68.15 | v65.97,75.15 U7.8
  Bottom 0.3: v59.7,65.6 60.75,65.6 61.3,66.15 RSTIM.0.2 62.35,68.15 63.15,68.95 64.1,68.95 64.25,68.95 65,68.2 65.05,68.15 v65.97,68.15 v70.97,68.15 72.3,69.47 72.3,72.9 72.3,73.83 v70.97,75.15 v65.97,75.15
  Bottom 0.4: OUTBUFFER.0.3 58.47,59.27 59.7,60.5 v59.7,65.6
HP_OUT.1  (via drill 0.35)
  Top 0.3: U12.8 v64.03,11.9 63.3,11.18 | v69.03,11.9 U11.8 | U10.8 64.03,4.9 | U8.8 v69.03,4.9 | 62.95,10.82 63.3,11.18 | 63.3,11.18 63,10.88 62.95,10.82 | HPAMPS.1.5 61.22,9.09 62.57,10.45 | 62.57,10.45 62.65,10.52 62.95,10.82 | 64.03,4.9 v64.03,4.85 | 62.57,10.45 62.57,8.34 64.03,6.88 64.03,4.9 | v50.4,20.54 v50.4,18.4
  Top 0.4: HPAMPS.1.5 v57.91,9.09 v57.9,9.1
  Bottom 0.3: v64.03,11.9 v69.03,11.9 | v69.03,4.9 68.89,5.03 64.2,5.03 v64.03,4.85 | v57.9,9.1 55.6,9.1 55.2,9.5 55.2,10.9 54.4,11.7 54,12.1 RSTIM.1.1 52.8,12.9 50.4,15.3 v50.4,18.4 | OUTBUFFER.1.3 v50.4,20.54
HP_OUT_BUF.0  (via drill 0.35)
  Top 0.4: v53.87,59.27 v55.1,60.5
  Bottom 0.3: RBOOT1.0.2 RBOOT2.0.1
  Bottom 0.4: v53.87,59.27 OUTBUFFER.0.6 50.63,59.27 50.6,59.3 49.3,60.6 49.3,64.9 50,65.6 RBOOT2.0.1 | v55.1,60.5 55.13,60.53 OUTBUFFER.0.2
HP_OUT_BUF.1
  Bottom 0.3: RBOOT1.1.2 50,11.7 | 50,11.7 RBOOT2.1.1 | OUTBUFFER.1.2 49.87,19.27 49.2,18.6 49,18.4 49,12.2 49,12 49.2,11.8 49.3,11.7 50,11.7
  Bottom 0.4: OUTBUFFER.1.2 53.87,19.27 55,20.4 55.13,20.54 OUTBUFFER.1.6
HPFINM0.0
  Bottom 0.3: 48.6,76.55 CH1.0.2 | 48.6,76.55 CH2.0.2 | RH1.0.2 48.5,76.65 48.6,76.55
HPFINM0.1
  Bottom 0.3: RH1.1.2 CH2.1.1 CH1.1.1
HPFINM1.0
  Bottom 0.3: RH3.0.2 36.5,76.7 | 36.5,76.7 CH4.0.2 | CH3.0.2 36.5,75.5 36.5,76.7
HPFINM1.1
  Bottom 0.3: CH3.1.1 36.4,4.85 | 36.4,4.85 CH4.1.1 | RH3.1.2 36.2,5.05 36.4,4.85
HPFINP0.0  (via drill 0.35)
  Top 0.3: v51.05,76.65 49.74,76.65 BANDPASSFILTER1.0.3
  Bottom 0.3: RH2.0.1 CH2.0.1 v51.05,76.65
HPFINP0.1  (via drill 0.35)
  Top 0.3: BANDPASSFILTER1.1.3 v50.9,5.13
  Bottom 0.3: RH2.1.2 CH2.1.2 49.77,5.13 v50.9,5.13
HPFINP1.0  (via drill 0.35)
  Top 0.3: BANDPASSFILTER2.0.3 v39.05,76.63
  Bottom 0.3: RH4.0.1 CH4.0.1 37.97,76.63 v39.05,76.63
HPFINP1.1  (via drill 0.35)
  Top 0.3: v38.9,5.03 BANDPASSFILTER2.1.3
  Bottom 0.3: RH4.1.2 CH4.1.2 37.72,5.03 v38.9,5.03
IN.0  (via drill 0.35)
  Top 0.3: U5.2 v65.33,68.9 | v70.3,68.9 70.3,71.19 U4.2 | U6.2 v70.33,75.9 | v65.35,75.9 65.35,76.58 65.34,76.59 65.34,78.2 U7.2
  Bottom 0.3: v70.3,68.9 v65.33,68.9 64.38,69.85 64.15,69.85 63.2,69.85 62.4,70.65 62.4,71.2 60.4,73.2 | v70.33,75.9 v65.35,75.9 65.25,75.9 64.85,76.3 63.8,76.3 63.5,76.3 | CAC1.0.1 58.6,73.5 58.9,73.2 60.4,73.2 | CRFI.0.2 62.6,76.7 63,76.3 63.5,76.3 | 60.4,73.2 63.5,76.3
IN.1  (via drill 0.35)
  Top 0.3: U11.2 v69.67,10.1 | v64.67,10.1 U12.2 | U8.2 v69.67,3.1 | U10.2 64.61,1.85 64.61,2.88 65.23,3.5 v65.28,3.5
  Bottom 0.3: v69.67,3.1 65.67,3.1 v65.28,3.5 64.44,2.67 62.83,2.67 62.05,3.45 | 62.05,3.45 62.05,8.6 63.55,10.1 v64.67,10.1 66.11,10.1 66.54,10.53 67.06,10.53 67.49,10.1 v69.67,10.1 | CAC1.1.1 58.6,2.35 58.8,2.15 60.65,2.15 CRFI.1.1 61.7,3.1 62.05,3.45
INM.0  (via drill 0.35)
  Top 0.3: v61.3,75.37 PREAMPLIFIER.0.2
  Bottom 0.3: CAC1.0.2 RAC1.0.2 59.94,75.37 v61.3,75.37
INM.1  (via drill 0.35)
  Top 0.3: PREAMPLIFIER.1.2 v61.1,4.37
  Bottom 0.3: CAC1.1.2 RAC1.1.2 59.94,4.37 v61.1,4.37
INP.0  (via drill 0.35)
  Top 0.3: v61,76.7 59.79,76.7 PREAMPLIFIER.0.3
  Bottom 0.3: CAC2.0.2 RAC2.0.1 v61,76.7
INP.1  (via drill 0.35)
  Top 0.3: PREAMPLIFIER.1.3 v61.1,5.63
  Bottom 0.3: CAC2.1.2 RAC2.1.1 59.97,5.63 v61.1,5.63
LPFINM0.0
  Bottom 0.3: RL2.0.1 RL1.0.2 CL1.0.2
LPFINM0.1
  Bottom 0.3: RL2.1.1 RL1.1.2 CL1.1.1
LPFINM1.0
  Bottom 0.3: RL3.0.1 RL4.0.2 CL3.0.2
LPFINM1.1
  Bottom 0.3: RL4.1.1 RL3.1.2 CL3.1.1
LPFINP0.0  (via drill 0.35)
  Top 0.3: v46.55,77.91 BANDPASSFILTER1.0.5
  Bottom 0.3: RL2.0.2 CL2.0.1 45.49,77.91 v46.55,77.91
LPFINP0.1  (via drill 0.35)
  Top 0.3: v46.75,6.41 BANDPASSFILTER1.1.5
  Bottom 0.3: RL2.1.2 CL2.1.2 45.7,6.41 v46.75,6.41
LPFINP1.0  (via drill 0.35)
  Top 0.3: BANDPASSFILTER2.0.5 v34.55,77.91
  Bottom 0.3: RL3.0.2 CL4.0.1 33.49,77.91 v34.55,77.91
LPFINP1.1  (via drill 0.35)
  Top 0.3: v34.8,6.3 BANDPASSFILTER2.1.5
  Bottom 0.3: RL4.1.2 CL4.1.2 33.7,6.3 v34.8,6.3
MID.0
  Bottom 0.3: RAC2.0.2 RAC1.0.1 RAC3.0.1
MID.1
  Bottom 0.3: RAC3.1.1 RAC1.1.1 RAC2.1.2
N$6
  Bottom 0.4: BOOSTFBPOT.1 RBOOSTFB0.2
NA_REF.0  (via drill 0.35)
  Top 0.3: PREAMPLIFIER.0.5 v57.3,77.91 | PGA.0.2 34.25,66.5 35,67.25 35,70.2 35.75,70.95 35.8,71 37.8,71 39.7,72.9 40.35,72.9 40.9,73.45 40.9,77.1 41.8,78 v42.6,78 | U1.6 26.57,74.37 27.33,75.13 28.06,75.13 28.09,75.1 v29.1,75.1
  Bottom 0.3: CL2.0.2 v42.6,78 41.8,78.8 | CL4.0.2 32.1,78.55 32.35,78.8 | 36.4,78.8 32.35,78.8 | 36.4,78.8 36.6,78.6 RH4.0.2 | 36.4,78.8 41.8,78.8 | 41.8,78.8 48.4,78.8 | 48.4,78.8 48.6,78.6 RH2.0.2 | 48.4,78.8 56.41,78.8 v57.3,77.91 RAC3.0.2 56.65,76.7 56.35,76.4 56.35,75.25 55.25,74.15 54.5,74.15 53.4,73.05 53.4,72.05 54.65,70.8 RHP1.0.1 | 32.35,78.8 30.3,78.8 29.1,77.6 v29.1,75.1
NA_REF.0.DIV  (via drill 0.35)
  Top 0.3: U1.3 v26.57,75.7
  Bottom 0.3: NAREFL.0.2 NAREFH.0.1 26.57,76.91 v26.57,75.7
NA_REF.1  (via drill 0.35)
  Top 0.3: v61.22,7.62 v61.21,7.63 56.33,7.63 v55.6,6.9 PREAMPLIFIER.1.5 51.34,6.91 v51,7.25 42.45,7.25 41.7,8 v32.25,8 32.25,9.1 32.25,11.73 32.25,12.26 32.29,12.31 32.48,12.5 PGA.1.2 | U2.6 28.23,9.34 v29.4,10.5
  Bottom 0.3: RAC3.1.2 56.8,5.7 v55.6,6.9 | CL2.1.1 44.3,6.8 44.75,7.25 48.6,7.25 | 48.6,7.25 v51,7.25 | RH2.1.1 48.4,7.05 48.6,7.25 | RHP0.1.2 61.25,10.15 61.25,7.65 v61.22,7.62 | CL4.1.1 32.3,7.05 32.6,7.35 | 32.6,7.35 36.05,7.35 36.4,7 RH4.1.1 | 32.6,7.35 32.25,7.7 v32.25,8 29.75,10.5 v29.4,10.5
NA_REF.1.DIV  (via drill 0.35)
  Top 0.4: U2.3 v28.23,5.2
  Bottom 0.3: NAREFL.1\.2 NAREFH.1.1
  Bottom 0.4: v28.23,5.2 28.23,3.91 NAREFH.1.1
PGAOUT1.0  (via drill 0.35)
  Top 0.3: v30.15,64.8 29.38,64.8 28.78,65.4 PGA.0.10
  Bottom 0.3: v30.15,64.8 31.2,65.85 31.2,71.25 31.7,71.75 36.7,71.75 37,71.75 37.9,72.65 CH3.0.1
PGAOUT1.1  (via drill 0.35)
  Top 0.3: PGA.1.10 29.55,12 v30.35,11.2
  Bottom 0.3: v30.35,11.2 31.5,10.05 34.9,10.05 36.2,8.75 37.3,8.75 39.8,6.25 39.8,4.3 39.25,3.75 CH3.1.2
PGAOUT2.0  (via drill 0.35)
  Top 0.2: ADC.0.6 25.95,68.95 27.9,67
  Top 0.3: PGA.0.8 27.9,67 27.8,66.9 27.1,66.2 v27.1,65.25
  Bottom 0.3: v27.1,65.25 27.7,65.25 27.9,65.45 CADC.0.2
PGAOUT2.1  (via drill 0.35)
  Top 0.3: ADC.1.6 25.25,10.6 25.5,10.35 26.7,10.35 27.6,11.25 27.6,12.7 27.9,13 PGA.1.8 30.75,13 v30.84,13.09
  Bottom 0.3: v30.84,13.09 29.95,12.2 CADC.1.1
PREAMPOUT.0  (via drill 0.35)
  Top 0.3: v52.7,76.6 54.24,76.6 PREAMPLIFIER.0.6
  Bottom 0.3: CH1.0.1 51.45,75.35 v52.7,76.6
PREAMPOUT.1  (via drill 0.35)
  Top 0.4: v52.95,5.6 54.24,5.6 PREAMPLIFIER.1.6
  Bottom 0.4: CH1.1.2 51.25,3.9 v52.95,5.6
REF.DIVIDE.0  (via drill 0.35)
  Top 0.3: AMPREF.0.3 v20.46,73.25
  Bottom 0.3: RBOOSTMID0.0.1 RBOOSTMID1.0.2 20.46,71.91 v20.46,73.25
REF.DIVIDE.1  (via drill 0.35)
  Top 0.4: v21.64,6.9 AMPREF.1.3
  Bottom 0.4: v21.64,6.9 21.64,8.02 RBOOSTMID0.1.2 RBOOSTMID1.1.1
REFOUT.0  (via drill 0.35)
  Top 0.3: AMPREF.0.6 20.46,68.61 21.75,69.9 21.75,71.55 AMPREF.0.2
  Top 0.4: AMPREF.0.2 v21.73,73.25
  Bottom 0.4: v21.73,73.25 23.32,73.25 CREF3.0.1 CREF2.0.1 23.35,78.85 23.85,79.35 58.15,79.35 | 58.15,79.35 58.6,78.9 CAC2.0.1 | 58.15,79.35 61.2,79.35 | 61.2,79.35 61.95,78.6 CRFI.0.1 | 61.2,79.35 72.75,79.35 74.73,77.37 J1.8 J1.6 J1.4 J1.2
REFOUT.1  (via drill 0.35)
  Top 0.4: AMPREF.1.6 21.64,11.68 21.6,11.65 20.36,10.41 AMPREF.1.2 20.35,8.52 v20.35,6.9 20.35,2 21.65,0.7 59.3,0.7 | J2.8 J2.6 J2.4 J2.2 74.73,1.33 74.55,1.15 74.1,0.7 v61.6,0.7 59.3,0.7 | v57.3,7 57.3,2.7 59.3,0.7
  Bottom 0.4: CREF2.1.1 CREF3.1.1 19.12,6.9 v20.35,6.9 | CRFI.1.2 v61.6,0.7 | CAC2.1.1 v57.3,7
VDD3.3  (via drill 0.35)
  Top 0.3: ADC.0.1 24.95,67.55 v25.45,68.05 ADC.0.7 25.45,69.65 26.5,70.7 27.3,70.7 27.8,71.2 27.84,71.23 U1.7 | v27.8,74.5 27.8,72.66 | ADC.1.7 25.75,12.15 26.2,12.6 26.25,12.65 ADC.1.1 26.25,14.85 26.57,15.18 v27.43,15.18 | PGA.1.7 30.25,13.5 v31.05,14.3 | v30.35,67.37 30.22,67.5 PGA.0.7
  Top 0.4: v46.55,74.1 BANDPASSFILTER1.0.8 | PREAMPLIFIER.0.7 v52.65,75.37 | DAC.0.3 v37.05,67 | v30.9,74.09 BANDPASSFILTER2.0.8 32.3,74.07 v32.3,70.7 | DAC.1.3 v38.95,13 | v46.75,2.6 BANDPASSFILTER1.1.8 | v52.95,4.37 PREAMPLIFIER.1.7 | v34.8,2.5 v34.8,2.49 BANDPASSFILTER2.1.8 v30.9,2.5 | U$2.09 U$2.11 | U$2.11 U$2.13 | U$2.84 v39.64,18.3 | U$2.11 v42.84,61.3 39.44,57.9 38.47,57.9 36.7,56.13 v36.7,27.44 | 27.8,72.66 U1.7 | U2.7 v26.96,6.1 | U$2.82 U$2.84 | U$2.86 U$2.84
  Bottom 0.3: CDECAP1.0.1 26.25,69.15 RADC.3.2
  Bottom 0.4: RDAC.2.1 38.9,68.1 CDECAP2.0.1 | 30.35,67.5 CDECAP3.0.1 29.2,68.25 28.3,69.15 27.9,69.55 RADC.3.2 | CDECAP0.1.1 53.84,75.37 v52.65,75.37 50.53,73.25 49.45,73.25 47.4,73.25 v46.55,74.1 CDECAP1.1.1 45.4,73.15 44.8,72.55 44.25,72.55 39.8,72.55 38.1,70.85 35.75,70.85 33.95,69.05 | CDECAP2.0.1 v37.05,67 37.14,67 39.74,64.4 41.68,64.4 42.85,63.23 42.85,61.31 v42.84,61.3 | CDECAP1.0.1 v25.45,68.05 | CDECAP0.0.1 v30.9,74.09 30.35,73.55 30.35,72.95 30.35,67.5 | RADC.1.2 CDECAP3.1.1 | RDAC.1.1 CDECAP5.1.1 v38.95,13 | CDECAP5.0.1 v46.75,2.6 47.8,1.55 | CDECAP2.1.1 54.09,4.37 v52.95,4.37 50.13,1.55 48.3,1.55 47.8,1.55 | CDECAP4.0.1 v34.8,2.5 35.75,1.55 47.8,1.55 | v38.95,13 32.35,13 v31.05,14.3 30.95,14.4 30.35,14.4 28.85,14.4 | CDECAP3.1.1 25.75,12.15 26.25,12.65 ADC.1.1 26.65,14.4 | 26.65,14.4 28.85,14.4 | 28.85,14.4 29.15,14.1 CDECAP4.1.1 | CDECAP3.1.1 27.25,11.05 29.6,8.7 | 29.6,8.7 29.6,8.8 28.15,7.35 CDECAPREF.1.1 26.96,7.31 v26.96,6.1 | 29.6,8.7 29.6,6.95 29.6,3.05 | v30.9,2.5 30.15,2.5 29.6,3.05 | CDECAP2.0.1 34.9,68.1 33.95,69.05 | 33.95,69.05 33.6,69.4 v32.3,70.7 | NAREFH.0.2 27.15,78.25 27.8,77.6 v27.8,74.5 CDECAPREF.0.1 | 29.6,3.05 29.1,2.55 NAREFH.1.2 | 26.65,14.4 v27.43,15.18 | 30.35,67.5 v30.35,67.37 | v36.7,27.44 36.7,23.51 35.89,22.7 35.89,20.88 36.58,20.19 37.75,20.19 v39.64,18.3 38.95,17.61 v38.95,13
VDD5.0  (via drill 0.35)
  Top 0.4: 38.84,61.5 U$2.01 U$2.03 | U$2.03 U$2.05 v40.44,61.49 v40.43,61.5 39.5,61.5 | U$2.03 39.64,61.64 39.5,61.5 | 39.5,61.5 38.84,61.5 | 38.84,61.5 31.74,54.4 v29.3,54.4
  Bottom 0.3: BOOSTCTRL.2 BOOSTCTRL.3 | 35.05,48.85 BOOSTCTRL.6
  Bottom 0.4: 35.05,48.85 CDECAPXEM1.1 35,49.5 34.5,50 29.3,50 | BOOSTCTRL.3 29.65,44.75 26.8,47.6 | 26.8,47.6 26.9,47.6 29.3,50 | 26.8,47.6 17.5,47.6 17,47.1 16.88,46.98 CVDD.1 | CVDD.1 CBIAS.1 19.65,38.6 U$1.P$1 21.05,41.1 19.95,42.2 CVDD.1 | 29.3,50 v29.3,54.4 | CDECAPXEM2.1 38.84,63.24 38.84,62.1 39.45,61.49 v40.44,61.49 39.48,60.52 CDECAPXEM0.1
  pour Bottom: 15.68,33.08 24.22,33.08 24.22,46.62 15.68,46.62
VDDHP.0  (via drill 0.35)
  Top 0.3: HPAMPS.0.8 59.74,70.95 | BOOTSTRAP.0.1 49.6,67.09 49.59,67.1 | 58.7,70.9 58.7,70.91
  Top 0.4: 49.6,67.09 51.05,67.09 52.73,65.42 | 58.7,70.9 58.5,70.7 58.5,68.95 54.97,65.42 52.73,65.42 | 58.7,70.91 HPAMPS.0.8 | v46.8,67.1 49.59,67.1 | 59.74,70.95 v61.49,70.95 | 52.73,65.42 v51,65.42
  Bottom 0.3: 60.6,70.95 CDECAP7.0.1
  Bottom 0.4: v46.8,67.1 46.35,67.55 CDECAP6.0.1 45.65,67.45 RBYPASSVDD.2 | v61.49,70.95 60.6,70.95 | OUTBUFFER.0.7 50.87,60.53 50.8,60.6 50.1,61.3 50.1,61.5 50.1,64.52 v51,65.42 51.82,64.6 CDECAP7.2.1
VDDHP.1  (via drill 0.35)
  Top 0.3: v59.7,14.25 HPAMPS.1.8 58.66,12.91 57.05,11.3 57.05,9.45 56,8.4 52.55,8.4 51.85,9.09 BOOTSTRAPPER.1.1 49.41,9.09 48.11,9.09 47.59,9.09 46.9,9.78 v46.9,9.85
  Bottom 0.3: CDECAP6.1.1 46.7,10.05 v46.9,9.85 | v59.7,14.25 CDECAP7.1.1 58.5,14.9 57.9,15.5 57.4,15.5 56.15,15.5 CDECAP7.3.1 55.05,18.75 55.5,19.2 55.56,19.27 OUTBUFFER.1.7
  Bottom 0.4: RBYPASSVDD.1.2 44.85,9.1 CDECAP6.1.1
VDDHV  (via drill 0.35)
  Top 0.3: v63.05,6.7 63.05,6.75 | U8.4 70.99,1.8 v71.9,1.8
  Top 0.4: U4.4 v68.2,71.22 | v68.2,78.22 U6.4 69.03,79.03 68.7,79.35 64.35,79.35 64.03,79.03 U7.4 | v63.2,71.22 U5.4 v64.03,68.15 | U7.4 v63.2,78.22 | v44.24,65.45 44.24,66.8 BOOTSTRAP.0.8 BOOTSTRAP.0.7 | AMPREF.0.7 v21.73,65.05 | AMPREF.1.7 v20.36,16.45 | U12.4 v66.95,8.78 | U11.4 v71.82,8.78 | v71.9,1.8 72.9,2.8 72.9,3.65 71.85,4.7 70.13,4.7 v70,4.83 | U10.4 65.99,1.8 v67.05,1.8 | BOOTSTRAPPER.1.7 BOOTSTRAPPER.1.8 44.49,9.05 v44.49,8 | 63.05,6.75 61.55,8.25 61.5,8.3 v57.1,8.3 | v64.35,75.67 64.35,75.75 64.02,76.08 64.02,77.28 64.03,77.29 U7.4
  Bottom 0.3: 63.22,71.2 v63.2,71.22 | 68.22,71.2 v68.2,71.22 | CCH4.0.1 64.33,78.22 | CDECAP9.1.1 69.33,78.22 | 44.08,66.72 CDECAP9.0.1 | 70.87,8.78 CCH1.0.1 | CCH6.1.1 65.77,8.78
  Bottom 0.4: 63.22,71.2 CCH2.0.1 64.7,72.65 | CCH3.0.1 68.22,71.2 67.6,71.2 67.55,71.25 66.15,72.65 64.7,72.65 | 64.33,78.22 v63.2,78.22 | 69.33,78.22 v68.2,78.22 | CREF1.0.1 44.08,66.72 | v44.24,65.45 44.05,65.64 CDECAP9.0.1 | CDECAP8.0.1 21.9,66.2 CREF0.0.1 21.73,66.34 | 21.73,66.34 v21.73,65.05 32.88,53.9 39.9,53.9 45.1,48.7 45.1,44.52 46.12,43.5 COUT2.1 | v64.03,68.15 65.65,66.53 65.65,64.95 65.65,64.22 48.12,46.7 48.12,44.5 COUT2.1 | CCH8.1.1 20.12,15.25 CREF1.1.1 | CREF1.1.1 20.36,15.04 v20.36,16.45 32.72,28.8 39.42,28.8 COUT3.1 | CCH5.1.1 v67.05,1.8 68.2,0.65 69.25,0.65 69.5,0.65 CCH7.1.1 v71.9,1.8 | 65.77,8.78 v66.95,8.78 67.57,8.78 68.17,8.18 69.18,8.18 69.21,8.15 70.03,8.15 | v71.82,8.78 70.87,8.78 70.67,8.78 70.03,8.15 | 70.03,8.15 69.83,7.95 69.73,7.85 69.73,7.79 69.72,7.78 69.72,5.11 v70,4.83 | CREF0.1.1 42.4,10.25 42.4,8.5 CDECAP8.1.1 v44.49,8 44.89,8 45.49,8.6 RBOOT3.1.2 46,7.95 46.15,7.8 50.35,7.8 50.75,8.2 50.85,8.3 v57.1,8.3 | CCH6.1.1 63.65,6.7 v63.05,6.7 | CREF0.1.1 42.45,10.65 41,12.1 41,14.8 41,28.2 47.12,34.33 47.12,34.5 COUT3.1 | CREF1.1.1 21.88,15.02 22.88,14.02 23,13.9 23,10.25 RBOOSTMID1.1.2 | 21.73,66.34 20.82,66.34 20.8,66.35 18.95,68.2 RBOOSTMID0.0.2 14.69,69.9 J4.1 | COUT2.1 46.62,44 46.62,61.16 44.24,63.55 v44.24,65.45 | COUT3.1 COUT1.1 | COUT1.1 COUT2.1 | COUT1.1 D1.1 40.41,39.35 40.74,39.35 40.86,39.23 40.86,38.49 39.7,37.34 RBOOSTFB1.2 39.9,36.5 COUT3.1 | v64.35,75.67 64.7,75.32 64.7,72.65 | v44.24,65.45 45.19,64.5 RBOOT3.0.2 46.95,65.45 RBYPASSVDD.1 | RBYPASSVDD.1.1 44.1,10.3 CREF0.1.1
  pour Bottom: 43.56,42.26 43.54,42.24 43.52,42.22 38.38,42.22 38.38,35.38 48.22,35.38 48.22,44.92 43.58,44.92 43.58,42.28
VDDHV_BYPASS
  Top 0.4: J4.3 J4.2
VSS  (via drill 0.35)
  Bottom 0.3: CDECAP3.0.2 29.2,66.2 CADC.0.1 | BOOSTCTRL.1 34.55,43.75 | 34.55,43.75 BOOSTCTRL.17 | BOOSTCTRL.16 34.55,43.75 | 34.55,43.75 BOOSTCTRL.17 | BOOSTCTRL.7 35.55,44.75 35.45,44.65 | 35.45,44.65 BOOSTCTRL.17 | BOOSTCTRL.11 35.85,44.25 35.45,44.65
  Bottom 0.4: CREF1.0.2 41.75,68.42 RBYPASSVSS.1
  other vias: 42.9,2.6 17.6,3.1 19.1,10.7 17.4,13.9 17.4,12.6 9,13.3 10.5,14.6 10.5,11.9 19.1,1.5 17.4,9.3 27.2,9.8 26.8,12 26.9,1.5 24.6,2.6 32.3,1.5 40.4,9.1 38.9,9.5 39.95,14.55 51.1,6.2 55.8,3.1 55.7,5.6 63.1,1.8 66.8,9.9 64.6,14.7 69.6,14.7 70.4,7.5 33.4,72.7 39.5,77.9 55.6,76.7 30.9,47.3 29.5,48.8 33.6,50.9 33.6,51.9 33.6,52.9 41.2,49.7 39.5,51.1 33.8,62.1 58.7,61.6 61.2,64.4 61.3,61.6 69.3,54.8 70.2,54.8 71.2,56.8 69.3,58.8 70.1,58.8 69.3,18.5 43.65,18.25 68.9,7.5 68.2,70.3 64.7,77 70.8,3.17 67.6,4.4 68.2,1.9 63.2,8.6 30.3,66.4 61.49,73.2 28.5,11.2 35.85,65.5 41.45,66.75 40.55,70.2 48.55,49.55 50.8,51.8 48.35,52.05 48.35,54.65 54.1,54.85 45.3,50.5 43.95,51.65 33.95,47.3 33.75,9.1 33.75,11 30.55,8.2 52.45,15.1 49.95,14.6 37.65,46.55
  pour Top: 0.08,0.08 79.92,0.08 79.92,79.92 0.08,79.92
  pour Bottom (rank 2): 0.2,0.2 79.8,0.2 79.8,79.8 0.2,79.8
VSS_BYPASS
  Top 0.4: J3.3 J3.2
VSSHP.0  (via drill 0.35)
  Top 0.4: HPAMPS.0.4 55.59,67.09 v57.1,68.6 | v46.8,69 47.44,69.64 BOOTSTRAP.0.3 50.56,69.64 53.1,67.1 53.1,67.09 HPAMPS.0.4 | HPAMPS.0.4 v54.3,66.1
  Bottom 0.3: CDECAP6.0.2 45.9,69
  Bottom 0.4: v57.1,68.6 57.1,70.4 57.75,71.05 CDECAP7.0.2 | 45.9,69 v46.8,69 | 55.1,58 OUTBUFFER.0.5 | 55.1,58 OUTBUFFER.0.4 | CDECAP7.2.2 55.05,65.35 v54.3,66.1 55.4,66.1 56.9,64.6 56.96,64.54 OUTBUFFER.0.1 54.7,61.8 54,61.1 54,60.4 55.1,59.3 55.1,58 | RBYPASSVSS.2 45.4,70 45.7,69.7 45.75,69.65 CDECAP6.0.2
VSSHP.1  (via drill 0.35)
  Top 0.3: 50.72,11.64 BOOTSTRAPPER.1.3 49.4,11.7 46.82,11.7 v46.8,11.72 | 50.72,11.64 53.25,9.1 53.26,9.09 HPAMPS.1.4 | 50.72,11.64 53.93,14.85 v55.4,14.85
  Top 0.4: v53.8,18.3 v53.8,20.8
  Bottom 0.3: CDECAP6.1.2 45.8,11.55 45.95,11.7 46.78,11.7 v46.8,11.72 | CDECAP7.1.2 56,14.25 v55.4,14.85 54.75,15.5 54.1,15.5 53.75,15.85 CDECAP7.3.2 52.6,16.6 52.04,17.16 OUTBUFFER.1.1
  Bottom 0.4: OUTBUFFER.1.4 53.8,21.8 | 53.8,21.8 OUTBUFFER.1.5 | OUTBUFFER.1.1 53.49,18 v53.8,18.3 | v53.8,20.8 53.8,21.8 | RBYPASSVSS.1.2 45.15,12 CDECAP6.1.2
(copper drawn outside any net)
  shapes: Bottom area x6, Top area x6

## Text on the board
tPlace: BYPASS POWER | BVSS | BVDD | VSS | VDDHV